# Altium schematic sheet [04] MCU.SchDoc
size A3; Organization: Altium Limited; Address1: L3, 12a Rodborough Rd; Address2: Frenchs Forest; Address3: NSW; Address4: Australia 2086
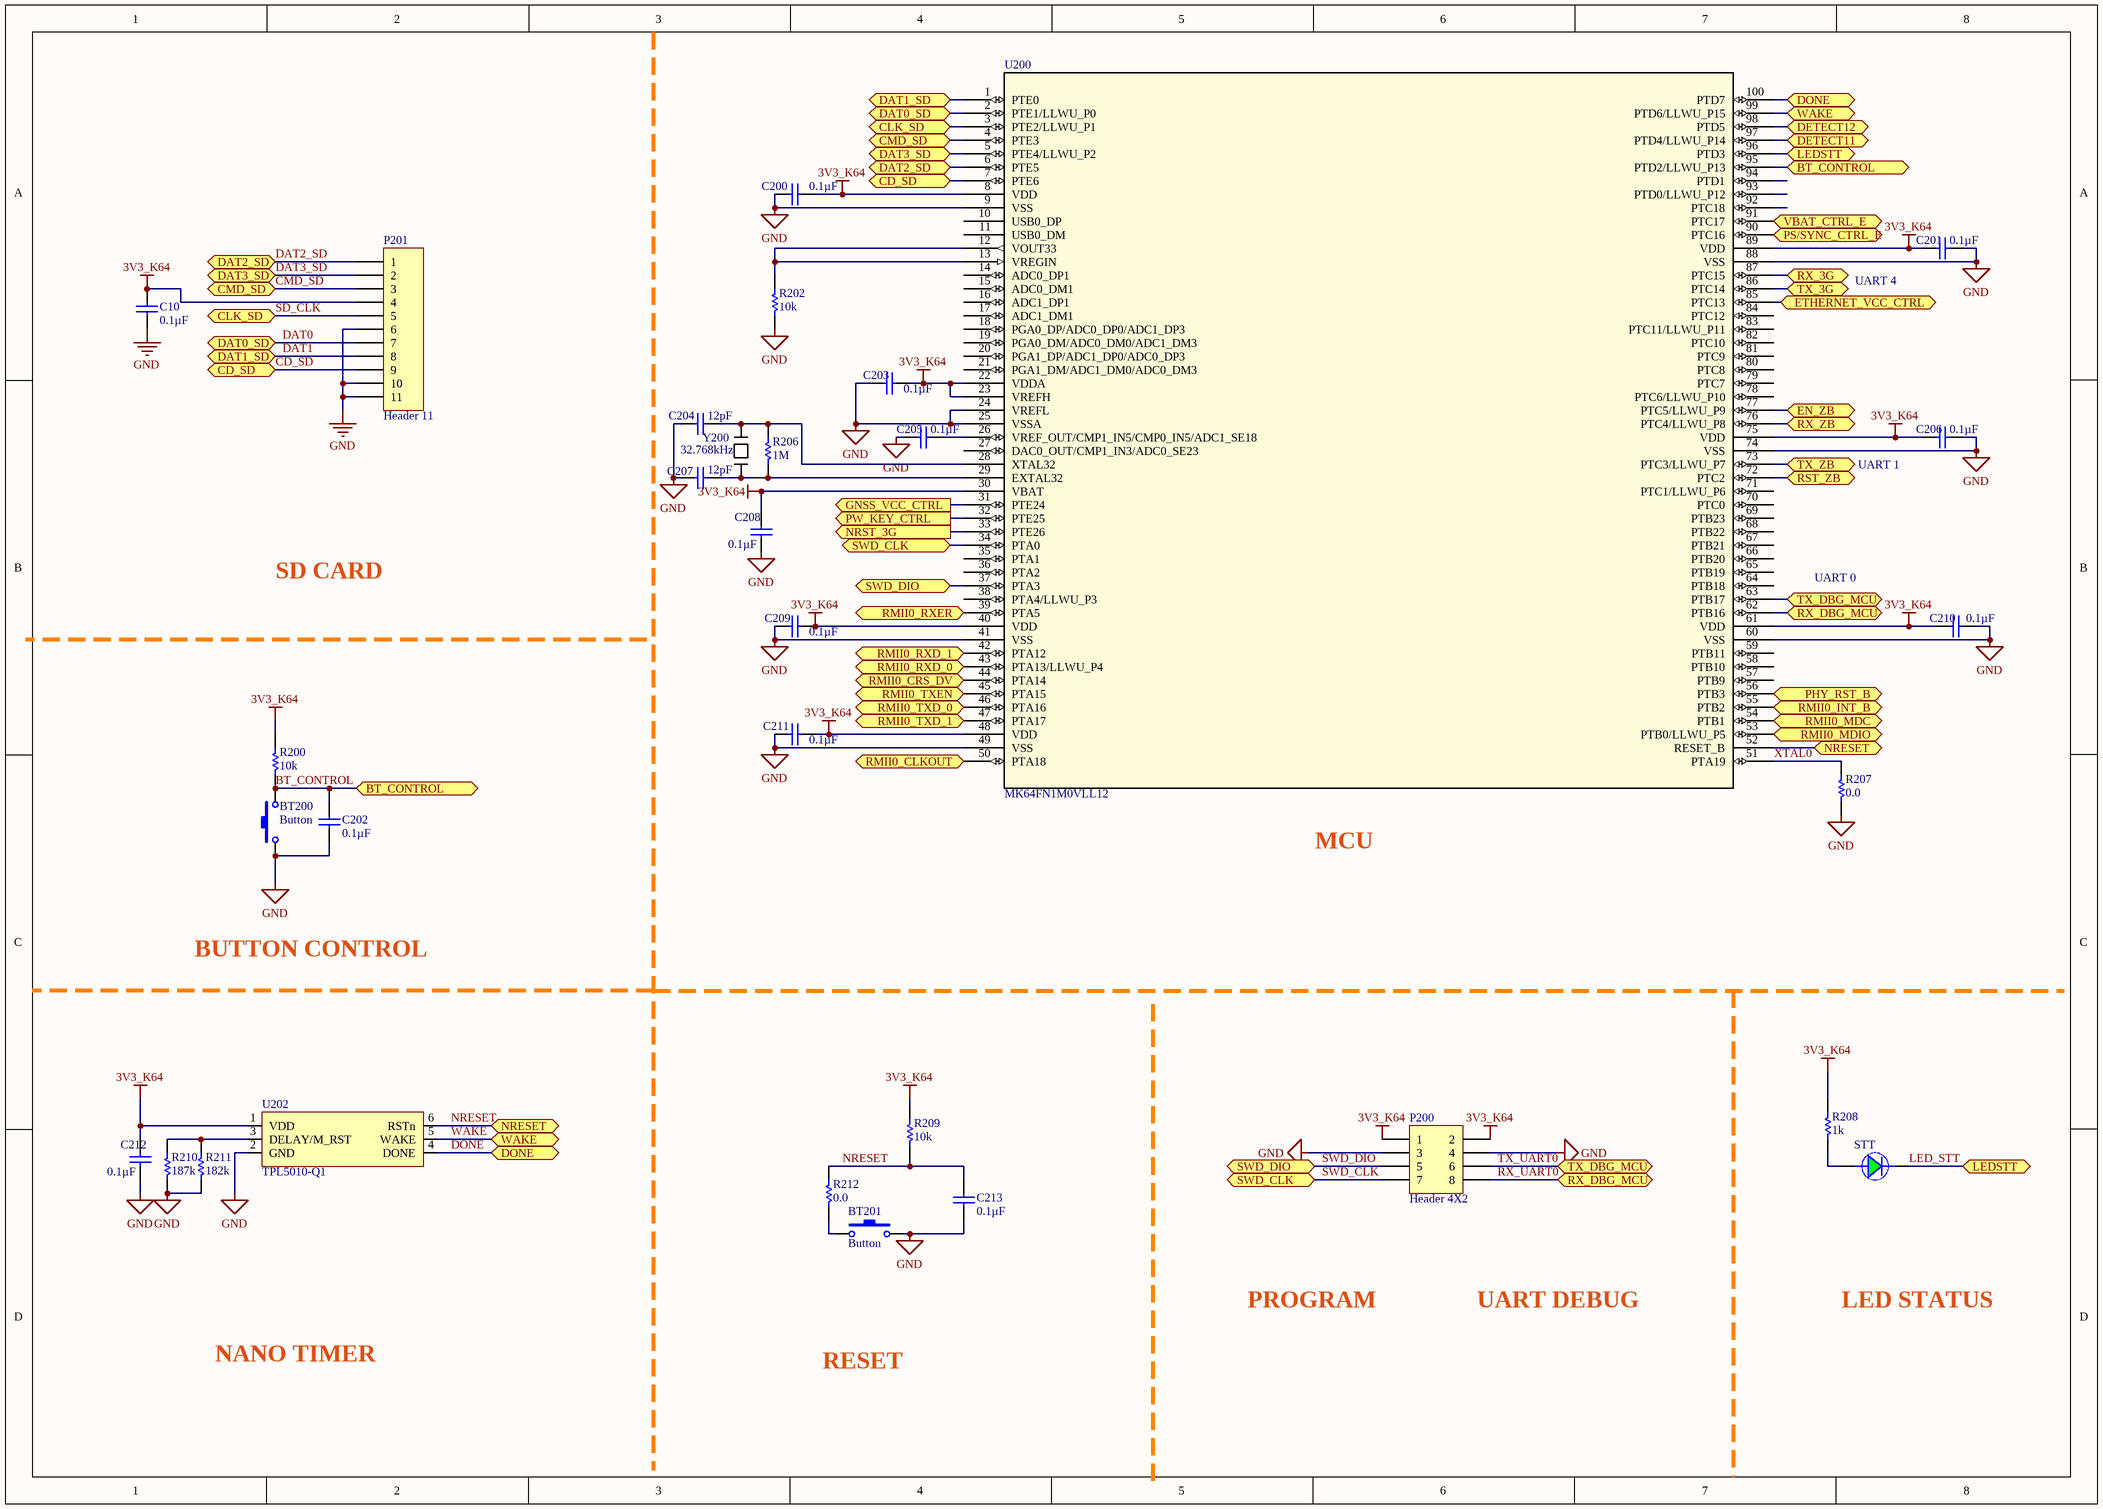
[diagram p0: [04] MCU.SchDoc]

## Parts
BT200  Button  [SWSMD]
BT201  Button  [SWSMD]
C10  0.1µF  [0402C]
C200  0.1µF  [0402C]
C201  0.1µF  [0402C]
C202  0.1µF  [0402C]
C203  0.1µF  [0402C]
C204  12pF  [0402C]
C205  0.1µF  [0402C]
C206  0.1µF  [0402C]
C207  12pF  [0402C]
C208  0.1µF  [0402C]
C209  0.1µF  [0402C]
C210  0.1µF  [0402C]
C211  0.1µF  [0402C]
C212  0.1µF  [0402C]
C213  0.1µF  [0402C]
P200  Header 4X2  [HDR2X4]
P201  Header 11  [TF_V3]
R200  10k  [0603R]
R202  10k  [0603R]
R206  1M  [0603R]
R207  0.0  [0603R]
R208  1k  [0603R]
R209  10k  [0603R]
R210  187k  [0603R]
R211  182k  [0603R]
R212  0.0  [0603R]
STT  (no value)  [0603LED-GREEN]
U200  MK64FN1M0VLL12  [LQFP-100_14X14X1]
U202  TPL5010-Q1  [SOT23-6]
Y200  32.768kHz  [ABS07-crystal]

## Ports
BT_CONTROL (bidir), CD_SD, CLK_SD, CMD_SD, DAT0_SD, DAT1_SD, DAT2_SD, DAT3_SD, DETECT11, DETECT12, DONE, EN_ZB, ETHERNET_VCC_CTRL (bidir), GNSS_VCC_CTRL (out), LEDSTT, NRESET, NRST_3G (out), PHY_RST_B (bidir), PS/SYNC_CTRL_E (out), PW_KEY_CTRL (out), RMII0_CLKOUT (bidir), RMII0_CRS_DV (bidir), RMII0_INT_B (bidir), RMII0_MDC (bidir), RMII0_MDIO (bidir), RMII0_RXD_0 (bidir), RMII0_RXD_1 (bidir), RMII0_RXER (bidir), RMII0_TXD_0 (bidir), RMII0_TXD_1 (bidir), RMII0_TXEN (bidir), RST_ZB, RX_3G, RX_DBG_MCU, RX_ZB, SWD_CLK, SWD_DIO, TX_3G, TX_DBG_MCU, TX_ZB, VBAT_CTRL_E (out), WAKE

## Nets
3V3_K64: C10.1 C200.1 C201.1 C203.1 C206.1 C208.1 C209.2 C210.1 C211.2 C212.2 P200.1 P200.2 P201.4 R200.1 R208.2 R209.1 U200.8(VDD) U200.22(VDDA) U200.23(VREFH) U200.30(VBAT) U200.40(VDD) U200.48(VDD) U200.61(VDD) U200.75(VDD) U200.89(VDD) U202.1(VDD)
GND: BT200.1 BT201.2 C10.2 C200.2 C201.2 C202.1 C203.2 C204.1 C205.2 C206.2 C207.1 C208.2 C209.1 C210.2 C211.1 C212.1 C213.1 P200.3 P200.4 P201.6 P201.10 P201.11 R202.1 R207.1 R210.1 R211.1 U200.9(VSS) U200.24(VREFL) U200.25(VSSA) U200.41(VSS) U200.49(VSS) U200.60(VSS) U200.74(VSS) U200.88(VSS) U202.2(GND)
BT_CONTROL: BT200.2 C202.2 R200.2 U200.95(PTD2/LLWU_P13) ; port BT_CONTROL
CD_SD: P201.9 U200.7(PTE6) ; port CD_SD
CMD_SD: P201.3 U200.4(PTE3) ; port CMD_SD
DAT0: P201.7 U200.2(PTE1/LLWU_P0) ; port DAT0_SD
DAT1: P201.8 U200.1(PTE0) ; port DAT1_SD
DAT2_SD: P201.1 U200.6(PTE5) ; port DAT2_SD
DAT3_SD: P201.2 U200.5(PTE4/LLWU_P2) ; port DAT3_SD
DETECT11: U200.97(PTD4/LLWU_P14) ; port DETECT11
DETECT12: U200.98(PTD5) ; port DETECT12
DONE: U200.100(PTD7) U202.4(DONE) ; port DONE
EN_ZB: U200.77(PTC5/LLWU_P9) ; port EN_ZB
ETHERNET_VCC_CTRL: U200.85(PTC13) ; port ETHERNET_VCC_CTRL
GNSS_VCC_CTRL: U200.31(PTE24) ; port GNSS_VCC_CTRL
LED_STT: STT.2(Katot) U200.96(PTD3) ; port LEDSTT
NRESET: C213.2 R209.2 R212.2 U200.52(RESET_B) U202.6(RSTn) ; port NRESET
NRST_3G: U200.33(PTE26) ; port NRST_3G
PHY_RST_B: U200.56(PTB3) ; port PHY_RST_B
PS/SYNC_CTRL_E: U200.90(PTC16) ; port PS/SYNC_CTRL_E
PW_KEY_CTRL: U200.32(PTE25) ; port PW_KEY_CTRL
RMII0_CLKOUT: U200.50(PTA18) ; port RMII0_CLKOUT
RMII0_CRS_DV: U200.44(PTA14) ; port RMII0_CRS_DV
RMII0_INT_B: U200.55(PTB2) ; port RMII0_INT_B
RMII0_MDC: U200.54(PTB1) ; port RMII0_MDC
RMII0_MDIO: U200.53(PTB0/LLWU_P5) ; port RMII0_MDIO
RMII0_RXD_0: U200.43(PTA13/LLWU_P4) ; port RMII0_RXD_0
RMII0_RXD_1: U200.42(PTA12) ; port RMII0_RXD_1
RMII0_RXER: U200.39(PTA5) ; port RMII0_RXER
RMII0_TXD_0: U200.46(PTA16) ; port RMII0_TXD_0
RMII0_TXD_1: U200.47(PTA17) ; port RMII0_TXD_1
RMII0_TXEN: U200.45(PTA15) ; port RMII0_TXEN
RST_ZB: U200.72(PTC2) ; port RST_ZB
RX_3G: U200.87(PTC15) ; port RX_3G
RX_UART0: P200.8 U200.62(PTB16) ; port RX_DBG_MCU
RX_ZB: U200.76(PTC4/LLWU_P8) ; port RX_ZB
SD_CLK: P201.5 U200.3(PTE2/LLWU_P1) ; port CLK_SD
SWD_CLK: P200.7 U200.34(PTA0) ; port SWD_CLK
SWD_DIO: P200.5 U200.37(PTA3) ; port SWD_DIO
TX_3G: U200.86(PTC14) ; port TX_3G
TX_UART0: P200.6 U200.63(PTB17) ; port TX_DBG_MCU
TX_ZB: U200.73(PTC3/LLWU_P7) ; port TX_ZB
VBAT_CTRL_E: U200.91(PTC17) ; port VBAT_CTRL_E
WAKE: U200.99(PTD6/LLWU_P15) U202.5(WAKE) ; port WAKE
XTAL0: R207.2 U200.51(PTA19)
NetBT201_1: BT201.1 R212.1
NetC204_2: C204.2 R206.2 U200.28(XTAL32) Y200.1
NetC205_1: C205.1 U200.26(VREF_OUT/CMP1_IN5/CMP0_IN5/ADC1_SE18)
NetC207_2: C207.2 R206.1 U200.29(EXTAL32) Y200.2
NetR202_2: R202.2 U200.12(VOUT33) U200.13(VREGIN)
NetR208_1: R208.1 STT.1(anot)
NetR210_2: R210.2 R211.2 U202.3(DELAY/M_RST)

Not connected (* = marked no-connect by the designer): U200 10(USB0_DP) 11(USB0_DM) 14(ADC0_DP1) 15(ADC0_DM1) 16(ADC1_DP1) 17(ADC1_DM1) 18(PGA0_DP/ADC0_DP0/ADC1_DP3) 19(PGA0_DM/ADC0_DM0/ADC1_DM3) 20(PGA1_DP/ADC1_DP0/ADC0_DP3) 21(PGA1_DM/ADC1_DM0/ADC0_DM3) 27(DAC0_OUT/CMP1_IN3/ADC0_SE23) 35(PTA1) 36(PTA2) 38(PTA4/LLWU_P3) 57(PTB9) 58(PTB10) 59(PTB11) 64(PTB18) 65(PTB19) 66(PTB20) 67(PTB21) 68(PTB22) 69(PTB23) 70(PTC0) 71(PTC1/LLWU_P6) 78(PTC6/LLWU_P10) 79(PTC7) 80(PTC8) 81(PTC9) 82(PTC10) 83(PTC11/LLWU_P11) 84(PTC12) 92(PTC18) 93(PTD0/LLWU_P12) 94(PTD1)

## Notes on the sheet
- (near C201) UART 4
- (near C206) UART 1
- SD CARD
- UART 0
- MCU
- BUTTON CONTROL
- PROGRAM
- UART DEBUG
- LED STATUS
- NANO TIMER
- RESET

## Library data of the parts
C10 C200-C203 C205 C206 C208-C213 = CAP0.1u0402: CAP CER 0.1UF 10V X7R 0402; Manufacturer: Taiyo Yuden; Manufacturer Part Number: LMK105B7104KVHF; Tolerance: ±10%; Supplier 1: Digi-Key; RoHS: RoHS Compliant; Category: Capacitors; Stock 1: 23930; Pricing 1: 1=0.1, 10=0.05, 100=0.0223, 500=0.01594, 1000=0.01252, 2500=0.01138, 5000=0.01047 (USD); Packaging: Cut Tape (CT); Part Status: Active; Capacitance: 0.1µF; Voltage - Rated: 10V; Temperature Coefficient: X7R; Operating Temperature: -55°C ~ 125°C; Features: -; Ratings: AEC-Q200; Applications: Automotive; Mounting Type: Surface Mount, MLCC; Package / Case: 0402 (1005 Metric); Size / Dimension: 0.039" L x 0.020" W (1.00mm x 0.50mm); Height - Seated (Max): -; Thickness (Max): 0.022" (0.55mm); Lead Spacing: -; Lead Style: -; ComponentLink1URL: http://www.yuden.co.jp/productdata/catalog/en/mlcc_all_hq_e.pdf; ComponentLink1Description: http://www.yuden.co.jp/productdata/catalog/en/mlcc_all_hq_e.pdf; Supplier Part Number 1: 587-3769-1-ND
C204 C207 = CAP12p0402: CAP CER 12PF 50V NP0 0402; Manufacturer: Taiyo Yuden; Manufacturer Part Number: UMK105CG120JV-F; Tolerance: ±5%; Temperature Coefficient: C0G, NP0; Supplier 1: Digi-Key; RoHS: RoHS Compliant; Category: Capacitors; Stock 1: 104058; Pricing 1: 1=0.1, 10=0.025, 100=0.0112, 500=0.00796, 1000=0.00626, 2500=0.00569, 5000=0.00524 (USD); Packaging: Cut Tape (CT); Part Status: Active; Capacitance: 12pF; Voltage - Rated: 50V; Operating Temperature: -55°C ~ 125°C; Features: -; Ratings: -; Applications: General Purpose; Mounting Type: Surface Mount, MLCC; Package / Case: 0402 (1005 Metric); Size / Dimension: 0.039" L x 0.020" W (1.00mm x 0.50mm); Height - Seated (Max): -; Thickness (Max): 0.022" (0.55mm); Lead Spacing: -; Lead Style: -; ComponentLink1URL: http://ds.yuden.co.jp/TYCOMPAS/ut/detail.do?productNo=UMK105CG120JV-F&fileName=UMK105CG120JV-F_SS&mode=specSheetDownload; ComponentLink1Description: http://ds.yuden.co.jp/TYCOMPAS/ut/detail.do?productNo=UMK105CG120JV-F&fileName=UMK105CG120JV-F_SS&mode=specSheetDownload; Supplier Part Number 1: 587-1948-1-ND
P200 = Header 4X2: Header, 4-Pin, Dual row; LatestRevisionDate: 17-Jul-2002; LatestRevisionNote: Re-released for DXP Platform.; Publisher: Altium Limited
P201 = Header 11: Header, 11-Pin; LatestRevisionDate: 17-Jul-2002; LatestRevisionNote: Re-released for DXP Platform.; Publisher: Altium Limited
R200 R202 R209 = RES10k0603: RES SMD 10K OHM 1% 1/10W 0603; Manufacturer: Panasonic Electronic Components; Manufacturer Part Number: ERJ-3EKF1002V; Power (Watts): 0.1W, 1/10W; Temperature Coefficient: ±100ppm/°C; Supplier 1: Digi-Key; RoHS: RoHS Compliant; Category: Resistors; Stock 1: 0; Pricing 1: 1=0.1, 10=0.021, 100=0.0087, 1000=0.00389, 2500=0.00338 (USD); Packaging: Digi-Reel®; Part Status: Active; Resistance (Ohms): 10k; Tolerance: ±1%; Composition: Thick Film; Features: Automotive AEC-Q200; Operating Temperature: -55°C ~ 155°C; Package / Case: 0603 (1608 Metric); Supplier Device Package: 0603; Size / Dimension: 0.063" L x 0.031" W (1.60mm x 0.80mm); Height - Seated (Max): 0.022" (0.55mm); Failure Rate: -; ComponentLink1URL: https://industrial.panasonic.com/cdbs/www-data/pdf/RDA0000/AOA0000C298.pdf; ComponentLink1Description: https://industrial.panasonic.com/cdbs/www-data/pdf/RDA0000/AOA0000C298.pdf; Supplier Part Number 1: P10.0KHDKR-ND
R206 = RES1M0603: RES SMD 1M OHM 1% 1/10W 0603; Manufacturer: Panasonic Electronic Components; Manufacturer Part Number: ERJ-3EKF1004V; Power (Watts): 0.1W, 1/10W; Temperature Coefficient: ±100ppm/°C; Supplier 1: Digi-Key; RoHS: RoHS Compliant; Category: Resistors; Stock 1: 0; Pricing 1: 1=0.1, 10=0.021, 100=0.0087, 1000=0.00389, 2500=0.00338 (USD); Packaging: Cut Tape (CT); Part Status: Active; Resistance (Ohms): 1M; Tolerance: ±1%; Composition: Thick Film; Features: Automotive AEC-Q200; Operating Temperature: -55°C ~ 155°C; Package / Case: 0603 (1608 Metric); Supplier Device Package: 0603; Size / Dimension: 0.063" L x 0.031" W (1.60mm x 0.80mm); Height - Seated (Max): 0.022" (0.55mm); Failure Rate: -; ComponentLink1URL: https://industrial.panasonic.com/cdbs/www-data/pdf/RDA0000/AOA0000C298.pdf; ComponentLink1Description: https://industrial.panasonic.com/cdbs/www-data/pdf/RDA0000/AOA0000C298.pdf; Supplier Part Number 1: P1.00MHCT-ND
R207 R212 = RES00603: RES SMD 0.0OHM JUMPER 1/10W 0603; Manufacturer: Panasonic Electronic Components; Manufacturer Part Number: ERJ-3GEY0R00V; Power (Watts): 0.1W, 1/10W; Supplier 1: Digi-Key; RoHS: RoHS Compliant; Category: Resistors; Stock 1: 8597757; Pricing 1: 1=0.1, 10=0.016, 25=0.0116, 50=0.0088, 100=0.0065, 250=0.00496, 500=0.00396, 1000=0.00292 (USD); Packaging: Cut Tape (CT); Part Status: Active; Resistance (Ohms): 0.0; Tolerance: Jumper; Composition: Thick Film; Features: Automotive AEC-Q200; Temperature Coefficient: -; Operating Temperature: -55°C ~ 155°C; Package / Case: 0603 (1608 Metric); Supplier Device Package: 0603; Size / Dimension: 0.063" L x 0.031" W (1.60mm x 0.80mm); Height - Seated (Max): 0.022" (0.55mm); Failure Rate: -; ComponentLink1URL: http://industrial.panasonic.com/www-cgi/jvcr13pz.cgi?E+PZ+3+AOA0001+ERJ3GEY0R00V+7+WW; ComponentLink1Description: http://industrial.panasonic.com/www-cgi/jvcr13pz.cgi?E+PZ+3+AOA0001+ERJ3GEY0R00V+7+WW; Supplier Part Number 1: P0.0GCT-ND
R208 = RES1k0603: RES SMD 1K OHM 1% 1/10W 0603; Manufacturer: Panasonic Electronic Components; Manufacturer Part Number: ERJ-3EKF1001V; Power (Watts): 0.1W, 1/10W; Temperature Coefficient: ±100ppm/°C; Supplier 1: Digi-Key; RoHS: RoHS Compliant; Category: Resistors; Stock 1: 0; Pricing 1: 1=0.1, 10=0.021, 100=0.0087, 1000=0.00389, 2500=0.00338 (USD); Packaging: Digi-Reel®; Part Status: Active; Resistance (Ohms): 1k; Tolerance: ±1%; Composition: Thick Film; Features: Automotive AEC-Q200; Operating Temperature: -55°C ~ 155°C; Package / Case: 0603 (1608 Metric); Supplier Device Package: 0603; Size / Dimension: 0.063" L x 0.031" W (1.60mm x 0.80mm); Height - Seated (Max): 0.022" (0.55mm); Failure Rate: -; ComponentLink1URL: https://industrial.panasonic.com/cdbs/www-data/pdf/RDA0000/AOA0000C298.pdf; ComponentLink1Description: https://industrial.panasonic.com/cdbs/www-data/pdf/RDA0000/AOA0000C298.pdf; Supplier Part Number 1: P1.00KHDKR-ND
R210 = Resistor: RES SMD 187K OHM 1% 1/10W 0603; Manufacturer: Panasonic Electronic Components; Manufacturer Part Number: ERJ-3EKF1873V; Power (Watts): 0.1W, 1/10W; Temperature Coefficient: ±100ppm/°C; Supplier 1: Digi-Key; Supplier Part Number 1: P187KHCT-ND; RoHS: RoHS Compliant; Category: Resistors; Stock 1: 17711; Pricing 1: 1=0.1, 10=0.021, 100=0.0087, 1000=0.00389, 2500=0.00338 (USD); Packaging: Cut Tape (CT); Part Status: Active; Resistance (Ohms): 187k; Tolerance: ±1%; Composition: Thick Film; Features: Automotive AEC-Q200; Operating Temperature: -55°C ~ 155°C; Package / Case: 0603 (1608 Metric); Supplier Device Package: 0603; Size / Dimension: 0.063" L x 0.031" W (1.60mm x 0.80mm); Height - Seated (Max): 0.022" (0.55mm); Failure Rate: -; ComponentLink1URL: https://industrial.panasonic.com/cdbs/www-data/pdf/RDA0000/AOA0000C298.pdf; ComponentLink1Description: https://industrial.panasonic.com/cdbs/www-data/pdf/RDA0000/AOA0000C298.pdf
R211 = Resistor: RES SMD 182K OHM 1% 1/10W 0603; Manufacturer: Panasonic Electronic Components; Manufacturer Part Number: ERJ-3EKF1823V; Power (Watts): 0.1W, 1/10W; Temperature Coefficient: ±100ppm/°C; Supplier 1: Digi-Key; Supplier Part Number 1: P182KHCT-ND; RoHS: RoHS Compliant; Category: Resistors; Stock 1: 140068; Pricing 1: 1=0.1, 10=0.021, 100=0.0087, 1000=0.00389, 2500=0.00338 (USD); Packaging: Cut Tape (CT); Part Status: Active; Resistance (Ohms): 182k; Tolerance: ±1%; Composition: Thick Film; Features: Automotive AEC-Q200; Operating Temperature: -55°C ~ 155°C; Package / Case: 0603 (1608 Metric); Supplier Device Package: 0603; Size / Dimension: 0.063" L x 0.031" W (1.60mm x 0.80mm); Height - Seated (Max): 0.022" (0.55mm); Failure Rate: -; ComponentLink1URL: https://industrial.panasonic.com/cdbs/www-data/pdf/RDA0000/AOA0000C298.pdf; ComponentLink1Description: https://industrial.panasonic.com/cdbs/www-data/pdf/RDA0000/AOA0000C298.pdf
STT = LedGreen0603: LED GREEN CLEAR 0603 SMD; Manufacturer: Everlight Electronics Co Ltd; Manufacturer Part Number: QTLP601C4TR; Lens Color: Colorless; Millicandela Rating: 15mcd; Lens Style/Size: Rectangle with Flat Top, 1.20mm x 0.80mm; Voltage - Forward (Vf) (Typ): 2.1V; Current - Test: 20mA; Viewing Angle: 120°; Wavelength - Dominant: 570nm; Wavelength - Peak: 565nm; Supplier 1: Digi-Key; RoHS: RoHS Compliant; Category: Optoelectronics; Stock 1: 19080; Pricing 1: 1=0.51, 10=0.366, 25=0.2808, 100=0.1832, 250=0.13432, 500=0.11396, 1000=0.09361 (USD); Packaging: Cut Tape (CT); Part Status: Active; Color: Green; Lens Transparency: Clear; Mounting Type: Surface Mount; Features: -; Package / Case: 0603 (1608 Metric); Supplier Device Package: 0603; Size / Dimension: 1.60mm L x 0.80mm W; Height (Max): 0.60mm; ComponentLink1URL: http://media.digikey.com/pdf/Data%20Sheets/Everlight%20PDFs/QTLP601C-2,3,4,7,B.pdf; ComponentLink1Description: http://media.digikey.com/pdf/Data%20Sheets/Everlight%20PDFs/QTLP601C-2,3,4,7,B.pdf; Supplier Part Number 1: 1080-1405-1-ND
U200 = MK64FN1M0VLL12: IC MCU 32BIT 1MB FLASH 100LQFP; Manufacturer: NXP USA Inc.; Core Processor: ARM® Cortex®-M4; Core Size: 32-Bit; Speed: 120MHz; Connectivity: CAN, EBI/EMI, Ethernet, I²C, IrDA, SD, SPI, UART/USART, USB, USB OTG; Peripherals: DMA, I²S, LVD, POR, PWM, WDT; Number of I/O: 66; Program Memory Size: 1MB (1M x 8); RAM Size: 256K x 8; Voltage - Supply (Vcc/Vdd): 1.71 V ~ 3.6 V; Data Converters: A/D 32x16b, D/A 1x12b; Oscillator Type: Internal; Supplier 1: Digi-Key; Manufacturer Part Number: MK64FN1M0VLL12; RoHS: RoHS Compliant; Category: Integrated Circuits (ICs); Stock 1: 0; Pricing 1: 1=13, 10=11.947, 100=10.7003 (USD); Packaging: Tray; Part Status: Active; Program Memory Type: FLASH; EEPROM Size: -; Operating Temperature: -40°C ~ 105°C (TA); Package / Case: 100-LQFP; Supplier Device Package: 100-LQFP (14x14); ComponentLink1URL: http://cache.freescale.com/files/microcontrollers/doc/data_sheet/K64P144M120SF5.pdf; ComponentLink1Description: http://cache.freescale.com/files/microcontrollers/doc/data_sheet/K64P144M120SF5.pdf; Supplier Part Number 1: MK64FN1M0VLL12-ND
U202 = TPL5010: IC TIMER W/WATCHDOG 6SOT; Manufacturer: Texas Instruments; Manufacturer Part Number: TPL5010QDDCRQ1; Voltage - Supply: 1.8 V ~ 5 V; Current - Supply: 35nA; Supplier 1: Digi-Key; RoHS: RoHS Compliant; Category: Integrated Circuits (ICs); Stock 1: 2785; Pricing 1: 1=1.27, 10=1.136, 100=0.886, 500=0.73192, 1000=0.57783 (USD); Packaging: Cut Tape (CT); Part Status: Active; Type: Programmable Timer; Count: -; Frequency: -; Operating Temperature: -40°C ~ 125°C; Package / Case: SOT-23-6 Thin, TSOT-23-6; Supplier Device Package: TSOT-23-6; Mounting Type: Surface Mount; ComponentLink1URL: http://www.ti.com/lit/ds/symlink/tpl5010-q1.pdf; ComponentLink1Description: http://www.ti.com/lit/ds/symlink/tpl5010-q1.pdf; Supplier Part Number 1: 296-44963-1-ND
Y200 = CRYSTAL32.768: CRYSTAL 32.7680KHZ 12.5PF SMD; Manufacturer: Abracon LLC; Manufacturer Part Number: ABS07-32.768KHZ-T; Frequency Tolerance: ±20ppm; ESR (Equivalent Series Resistance): 70 kOhm; Operating Mode: Fundamental; Supplier 1: Digi-Key; RoHS: RoHS Compliant; Category: Crystals, Oscillators, Resonators; Stock 1: 409054; Pricing 1: 1=1.09, 10=0.961, 50=0.8988, 100=0.7942, 500=0.7524, 1000=0.627 (USD); Packaging: Digi-Reel®; Part Status: Active; Type: kHz Crystal (Tuning Fork); Frequency: 32.768kHz; Frequency Stability: -; Load Capacitance: 12.5pF; Operating Temperature: -40°C ~ 85°C; Ratings: -; Mounting Type: Surface Mount; Package / Case: 2-SMD, No Lead; Size / Dimension: 0.126" L x 0.061" W (3.20mm x 1.50mm); Height - Seated (Max): 0.035" (0.90mm); ComponentLink1URL: http://www.abracon.com/Resonators/ABS07.pdf; ComponentLink1Description: http://www.abracon.com/Resonators/ABS07.pdf; Supplier Part Number 1: 535-9542-6-ND